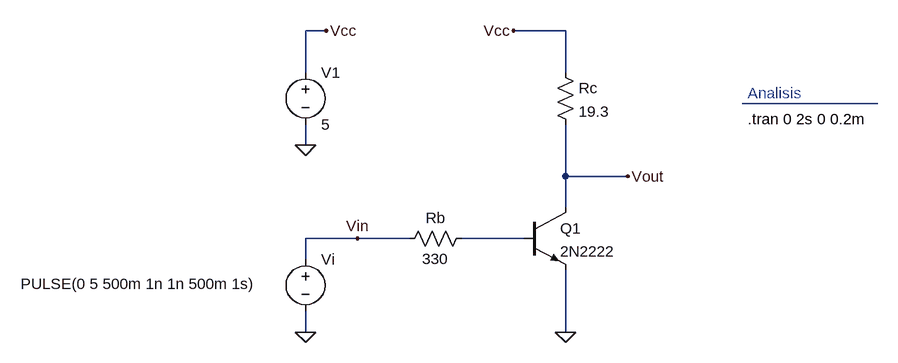
[diagram p0: schematic bjt_motor-driver.asc]
bjt_motor-driver.asc, the LTspice schematic file:
Version 4
SHEET 1 1052 680
WIRE -288 -176 -320 -176
WIRE 80 -176 0 -176
WIRE -320 -112 -320 -176
WIRE 80 -112 80 -176
WIRE 560 -64 352 -64
WIRE -320 0 -320 -32
WIRE 80 48 80 -32
WIRE 176 48 80 48
WIRE 80 96 80 48
WIRE -240 144 -320 144
WIRE -160 144 -240 144
WIRE 16 144 -80 144
WIRE -320 176 -320 144
WIRE -320 288 -320 256
WIRE 80 288 80 192
FLAG 80 288 0
FLAG -320 0 0
FLAG -288 -176 Vcc
FLAG -320 288 0
FLAG 0 -176 Vcc
FLAG -240 144 Vin
FLAG 176 48 Vout
SYMBOL npn 16 96 R0
SYMATTR InstName Q1
SYMATTR Value 2N2222
SYMBOL res -176 160 R270
WINDOW 0 32 56 VTop 2
WINDOW 3 0 56 VBottom 2
SYMATTR InstName Rb
SYMATTR Value 330
SYMBOL res 64 -128 R0
SYMATTR InstName Rc
SYMATTR Value 19.3
SYMBOL voltage -320 -128 R0
WINDOW 123 0 0 Left 0
WINDOW 39 0 0 Left 0
SYMATTR InstName V1
SYMATTR Value 5
SYMBOL voltage -320 160 R0
WINDOW 3 -438 54 Left 2
WINDOW 123 0 0 Left 0
WINDOW 39 0 0 Left 0
SYMATTR Value PULSE(0 5 500m 1n 1n 500m 1s)
SYMATTR InstName Vi
TEXT 360 -40 Left 2 !.tran 0 2s 0 0.2m
TEXT 360 -80 Left 2 ;Analisis

The netlist it stands for:
* bjt_motor-driver.asc
Q1 Vout N002 0 0 2N2222
Rb Vin N002 330
Rc Vcc Vout 19.3
V1 Vcc 0 5
Vi Vin 0 PULSE(0 5 500m 1n 1n 500m 1s)
.model NPN NPN
.model PNP PNP
.lib standard.bjt
.tran 0 2s 0 0.2m
* Analisis
.backanno
.end

* Results of the author's LTspice run, read from the files saved beside the schematic
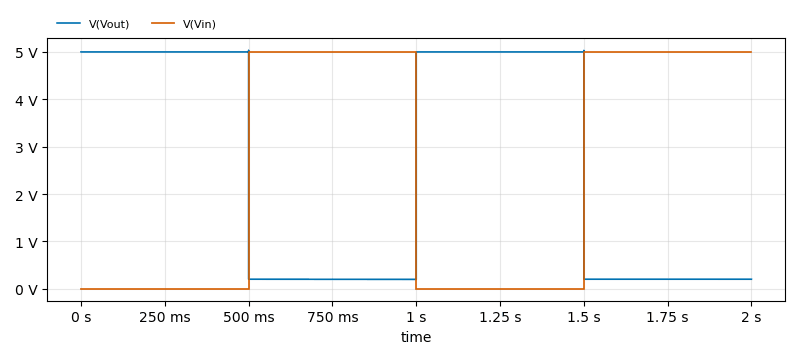
[diagram p1: Transient Analysis of bjt_motor-driver.asc, plotted from the saved traces]
* Transient Analysis, 1 run:
*   V(Vout): min 197.7 mV, max 5.033 V, average 2.601 V, rms 3.538 V, last 202.1 mV
*   V(Vin): min 0 V, max 5 V, average 2.5 V, rms 3.536 V, last 5 V